# Altium schematic sheet SCH_LoraRemote.SchDoc
size A3; SheetNumber: 1; SheetTotal: 2
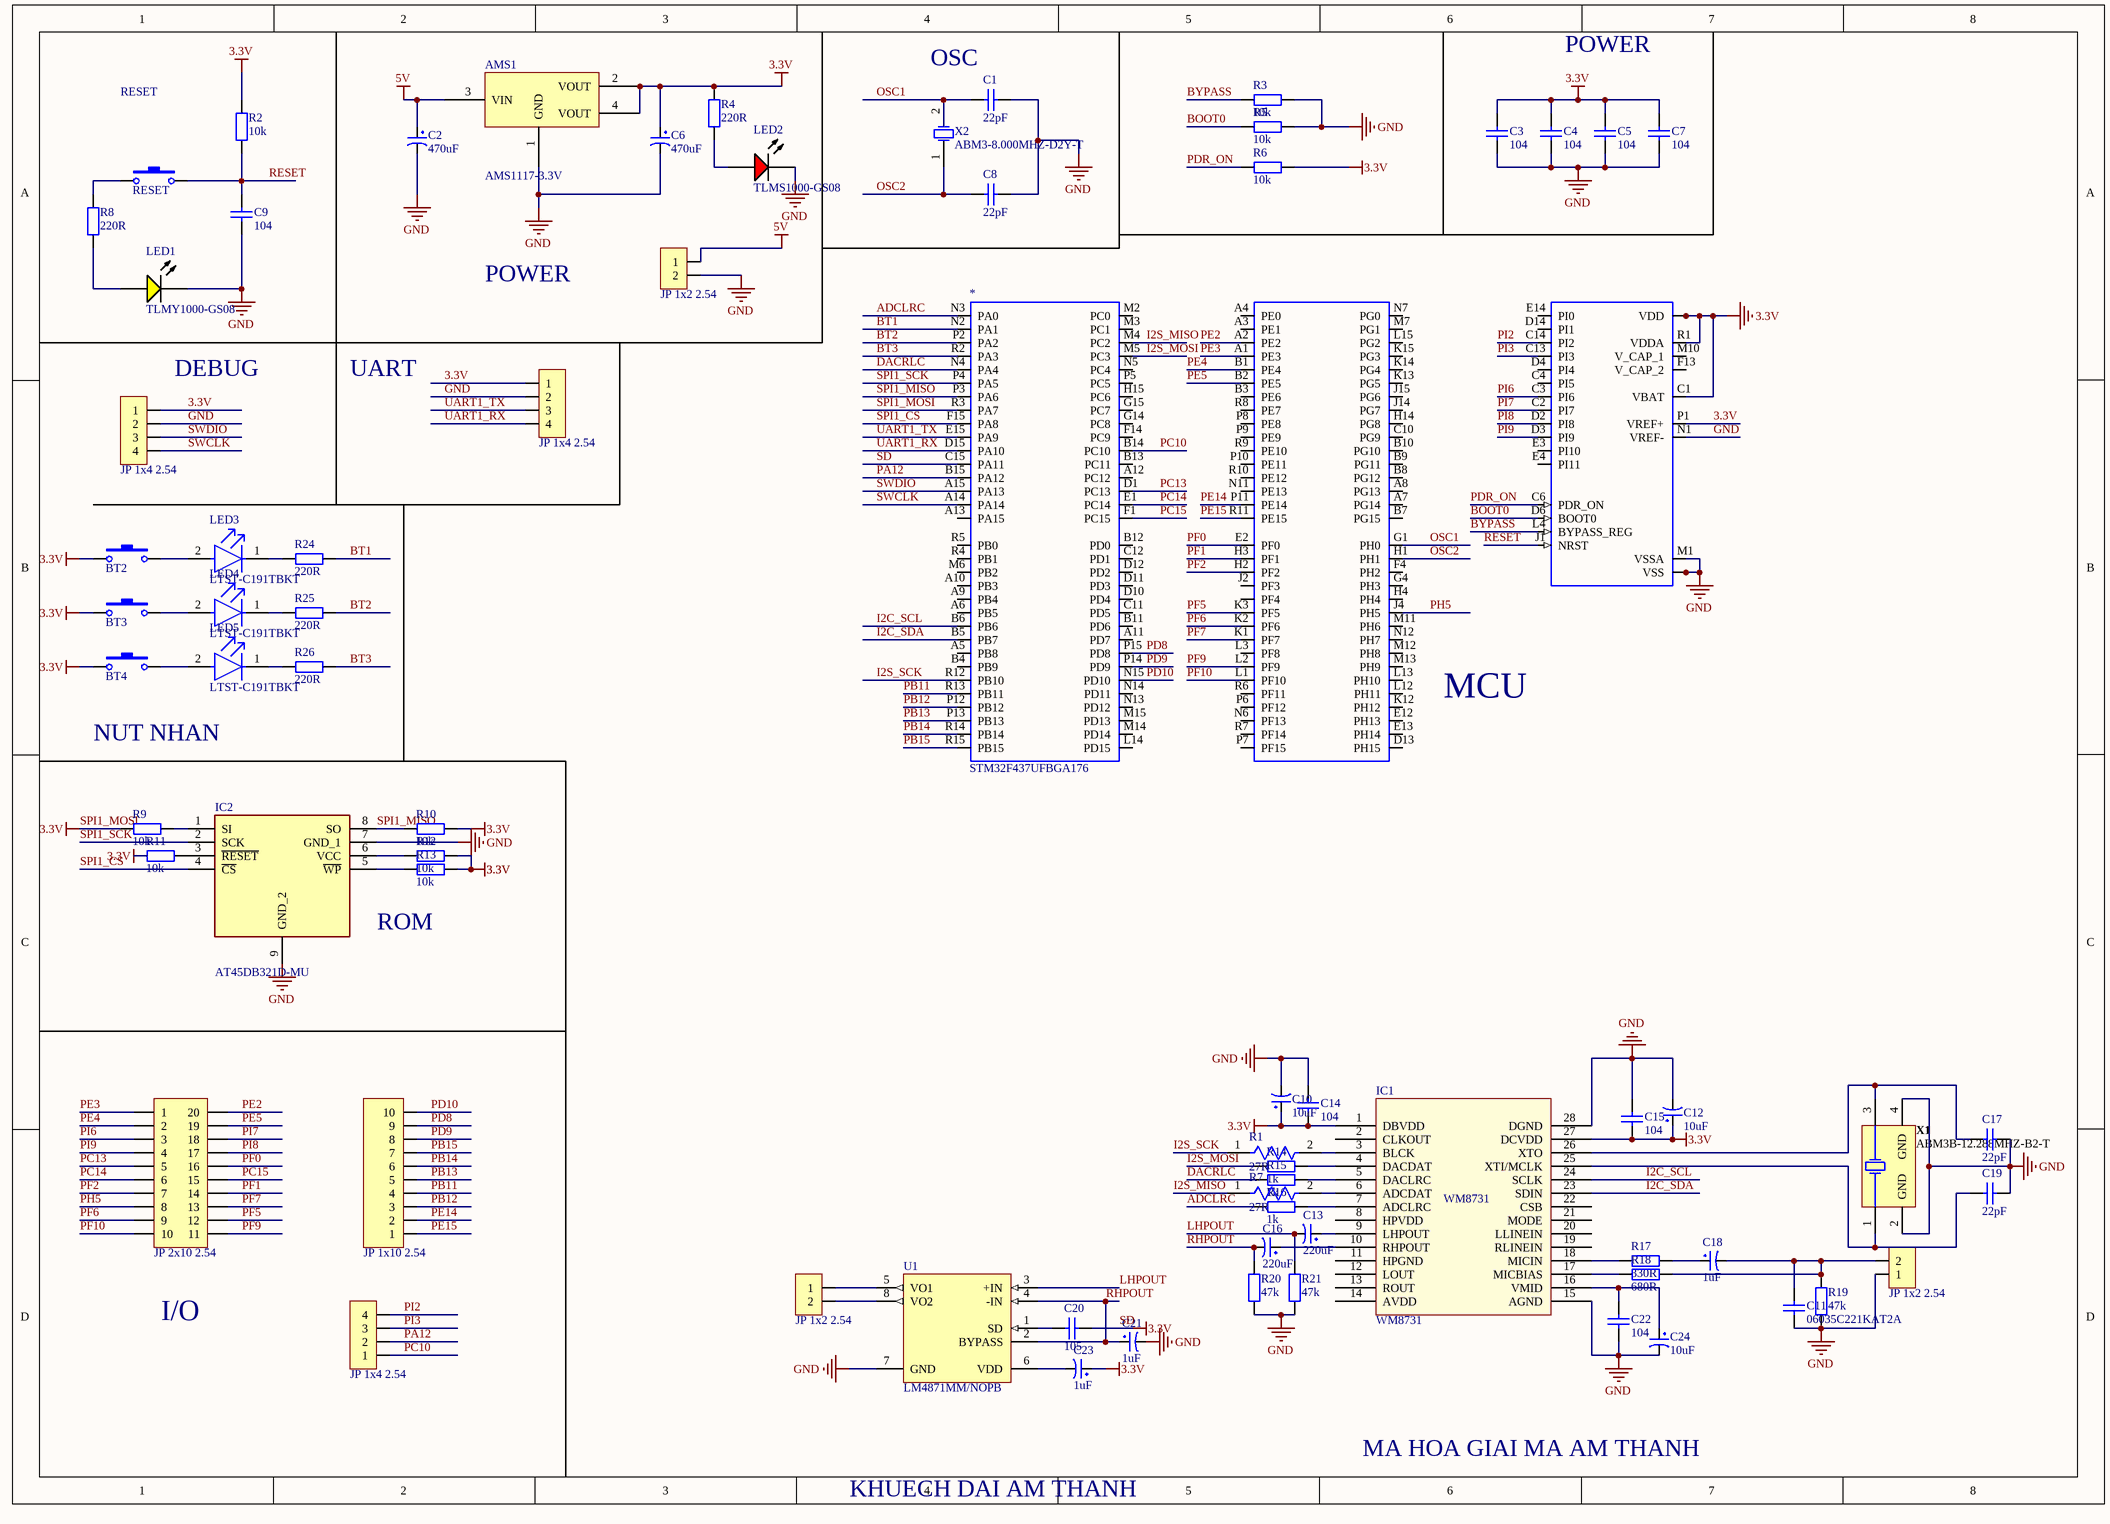
[diagram p0: SCH_LoraRemote.SchDoc]

## Parts
*  STM32F437UFBGA176  [stm32f407BGA176]
?  JP 1x4 2.54  [JP 1x4 DT]
AMS1  AMS1117-3.3V  [SOT223]
BT2  Nut Nhan 2 Chan SMD 3x6x2.5  [Nut Nhan 2 Chan SMD 3x6x2.5]  (value not drawn)
BT3  Nut Nhan 2 Chan SMD 3x6x2.5  [Nut Nhan 2 Chan SMD 3x6x2.5]  (value not drawn)
BT4  Nut Nhan 2 Chan SMD 3x6x2.5  [Nut Nhan 2 Chan SMD 3x6x2.5]  (value not drawn)
C1  22pF  [tu 0603]
C2  470uF  [tu tantalum smd7343]
C3  104  [tu 0603]
C4  104  [tu 0603]
C5  104  [tu 0603]
C6  470uF  [tu tantalum smd7343]
C7  104  [tu 0603]
C8  22pF  [tu 0603]
C9  104  [tu 0603]
C10  10uF  [tu tantalum smd3216]
C11  06035C221KAT2A  [CAPC1608X90X35ML15T15]
C12  10uF  [tu tantalum smd3216]
C13  220uF  [tu tantalum smd7343]
C14  104  [tu 0603]
C15  104  [tu 0603]
C16  220uF  [tu tantalum smd7343]
C17  22pF  [tu 0603]
C18  1uF  [tu tantalum smd3216]
C19  22pF  [tu 0603]
C20  105  [tu 0603]
C21  1uF  [tu tantalum smd3216]
C22  104  [tu 0603]
C23  1uF  [tu tantalum smd3216]
C24  10uF  [tu tantalum smd3216]
IC1  WM8731  [WM8731_SSOP]
IC2  AT45DB321D-MU  [SON127P600X500X100-9N-D]
JP1  JP 1x2 2.54  [JP 1x2 DT]
JP2  JP 1x2 2.54  [JP 1x2 DT]
JP3  JP 1x4 2.54  [JP 1x4 DT]
JP4  JP 1x10 2.54  [JP 1x10 DT]
JP5  JP 1x2 2.54  [JP 1x2 DT]
JP6  JP 2x10 2.54  [JP 2x10 DT]
JP7  JP 1x4 2.54  [JP 1x4 DT]
LED1  TLMY1000-GS08  [VISH-TLMY1000_V]
LED2  TLMS1000-GS08  [VISH-TLMS1000_V]
LED3  LTST-C191TBKT  [FP-LTST-C191TBKT-MFG]
LED4  LTST-C191TBKT  [FP-LTST-C191TBKT-MFG]
LED5  LTST-C191TBKT  [FP-LTST-C191TBKT-MFG]
R1  27R  [FP-CRCW0603-HPe3-IPC_B]
R2  10k  [tro smd 0603]
R3  10k  [tro smd 0603]
R4  220R  [tro smd 0603]
R5  10k  [tro smd 0603]
R6  10k  [tro smd 0603]
R7  27R  [FP-CRCW0603-HPe3-IPC_B]
R8  220R  [tro smd 0603]
R9  10k  [tro smd 0603]
R10  10k  [tro smd 0603]
R11  10k  [tro smd 0603]
R12  10k  [tro smd 0603]
R13  10k  [tro smd 0603]
R14  1k  [tro smd 0603]
R15  1k  [tro smd 0603]
R16  1k  [tro smd 0603]
R17  330R  [tro smd 0603]
R18  680R  [tro smd 0603]
R19  47k  [tro smd 0603]
R20  47k  [tro smd 0603]
R21  47k  [tro smd 0603]
R24  220R  [tro smd 0603]
R25  220R  [tro smd 0603]
R26  220R  [tro smd 0603]
RESET  Nut Nhan 2 Chan SMD 3x6x2.5  [Nut Nhan 2 Chan SMD 3x6x2.5]  (value not drawn)
U1  LM4871MM/NOPB  [DGK0008A_L]
X1  ABM3B-12.288MHZ-B2-T  [ABRA-ABM3B-4_V]
X2  ABM3-8.000MHZ-D2Y-T  [ABRA-ABM3-2_V]

## Nets
3.3V: *.C1(VBAT) *.C5(VDD) *.C7(VDD) *.C8(VDD) *.C9(VDD) *.C15(PA11) *.F3(VDD) *.G3(VDD) *.G13(VDD) *.H13(VDD) *.J12(VDD) *.J13(VDD) *.K4(VDD) *.N8(VDD) *.N9(VDD) *.N10(VDD) *.P1(VREF+) *.R1(VDDA) *.R3(PA7) ?.1 AMS1.2(VOUT) AMS1.4(VOUT) BT2.1 BT3.1 BT4.1 C3.1 C4.1 C5.1 C6.1 C7.1 C10.1 C12.1 C14.2 C15.2 C20.1 C23.1 IC1.1(DBVDD) IC1.27(DCVDD) JP3.1 R2.2 R4.2 R6.2 R9.1 R10.2 R11.1 R12.2 R13.2  [also labelled SD, SPI1_MOSI]
5V: AMS1.3(VIN) C2.1 JP1.1
GND: *.D5(VSS) *.D7(VSS) *.D8(VSS) *.D9(VSS) *.F2(VSS) *.F6(VSS) *.F7(VSS) *.F8(VSS) *.F9(VSS) *.F10(VSS) *.F12(VSS) *.G2(VSS) *.G6(VSS) *.G7(VSS) *.G8(VSS) *.G9(VSS) *.G10(VSS) *.G12(VSS) *.H6(VSS) *.H7(VSS) *.H8(VSS) *.H9(VSS) *.H10(VSS) *.H12(VSS) *.J6(VSS) *.J7(VSS) *.J8(VSS) *.J9(VSS) *.J10(VSS) *.K6(VSS) *.K7(VSS) *.K8(VSS) *.K9(VSS) *.K10(VSS) *.M1(VSSA) *.M8(VSS) *.M9(VSS) *.N1(VREF-) ?.2 AMS1.1(GND) C1.1 C2.2 C3.2 C4.2 C5.2 C6.2 C7.2 C8.1 C9.2 C10.2 C11.1 C12.2 C14.1 C15.1 C17.1 C19.1 C21.2 C22.2 C24.2 IC1.15(AGND) IC1.28(DGND) IC2.7(GND_1) IC2.9(GND_2) JP1.2 JP3.2 JP5.1 LED1.2(K) LED2.2(K) R3.2 R5.2 R19.1 R20.1 R21.1 U1.7(GND) X1.2(GND) X1.4(GND)
ADCLRC: *.N3(PA0) R16.1
BOOT0: *.D6(BOOT0) R5.1
BT1: *.N2(PA1) R24.2
BT2: *.P2(PA2) R25.2
BT3: *.R2(PA3) R26.2
BYPASS: *.L4(BYPASS_REG) R3.1
DACRLC: *.N4(PA4) R15.1
I2C_SCL: *.B6(PB6) IC1.24(SCLK)
I2C_SDA: *.B5(PB7) IC1.23(SDIN)
I2S_MISO: *.M4(PC2) R7.1
I2S_MOSI: *.M5(PC3) R14.1
I2S_SCK: *.R12(PB10) R1.1
LHPOUT: C13.2 R21.2 U1.3(+IN)
OSC1: *.G1(PH0) C1.2 X2.2(X2)
OSC2: *.H1(PH1) C8.2 X2.1(X1)
PA12: *.B15(PA12) JP7.2
PB11: *.R13(PB11) JP4.4
PB12: *.P12(PB12) JP4.3
PB13: *.P13(PB13) JP4.5
PB14: *.R14(PB14) JP4.6
PB15: *.R15(PB15) JP4.7
PC10: *.B14(PC10) JP7.1
PC13: *.D1(PC13) JP6.5
PC14: *.E1(PC14) JP6.6
PC15: *.F1(PC15) JP6.15
PD8: *.P15(PD8) JP4.9
PD9: *.P14(PD9) JP4.8
PD10: *.N15(PD10) JP4.10
PDR_ON: *.C6(PDR_ON) R6.1
PE2: *.A2(PE2) JP6.20
PE3: *.A1(PE3) JP6.1
PE4: *.B1(PE4) JP6.2
PE5: *.B2(PE5) JP6.19
PE14: *.P11(PE14) JP4.2
PE15: *.R11(PE15) JP4.1
PF0: *.E2(PF0) JP6.16
PF1: *.H3(PF1) JP6.14
PF2: *.H2(PF2) JP6.7
PF5: *.K3(PF5) JP6.12
PF6: *.K2(PF6) JP6.9
PF7: *.K1(PF7) JP6.13
PF9: *.L2(PF9) JP6.11
PF10: *.L1(PF10) JP6.10
PH5: *.J4(PH5) JP6.8
PI2: *.C14(PI2) JP7.4
PI3: *.C13(PI3) JP7.3
PI6: *.C3(PI6) JP6.3
PI7: *.C2(PI7) JP6.18
PI8: *.D2(PI8) JP6.17
PI9: *.D3(PI9) JP6.4
RESET: *.J1(NRST) C9.1 R2.1 RESET.2
RHPOUT: C16.2 C21.1 R20.2 U1.2(BYPASS) U1.4(-IN)
SPI1_CS: *.F15(PA8) IC2.4(~{CS})
SPI1_MISO: *.P3(PA6) IC2.8(SO) R10.1
SPI1_SCK: *.P4(PA5) IC2.2(SCK)
SWCLK: *.A14(PA14) JP3.4
SWDIO: *.A15(PA13) JP3.3
UART1_RX: *.D15(PA10) ?.4
UART1_TX: *.E15(PA9) ?.3
NetBT2_2: BT2.2 LED3.2(A)
NetBT3_2: BT3.2 LED4.2(A)
NetBT4_2: BT4.2 LED5.2(A)
NetC11_2: C11.2 C18.2 JP5.2 R18.2 R19.2
NetC13_1: C13.1 IC1.9(LHPOUT)
NetC16_1: C16.1 IC1.10(RHPOUT)
NetC17_2: C17.2 IC1.26(XTO) X1.3(X2)
NetC18_1: C18.1 R17.2
NetC19_2: C19.2 IC1.25(XTI/MCLK) X1.1(X1)
NetC20_2: C20.2 U1.1(SD)
NetC22_1: C22.1 C24.1 IC1.16(VMID)
NetC23_2: C23.2 U1.6(VDD)
NetIC1_3: IC1.3(BLCK) R1.2
NetIC1_4: IC1.4(DACDAT) R14.2
NetIC1_5: IC1.5(DACLRC) R15.2
NetIC1_6: IC1.6(ADCDAT) R7.2
NetIC1_7: IC1.7(ADCLRC) R16.2
NetIC1_17: IC1.17(MICBIAS) R18.1
NetIC1_18: IC1.18(MICIN) R17.1
NetIC2_1: IC2.1(SI) R9.2
NetIC2_3: IC2.3(~{RESET}) R11.2
NetIC2_5: IC2.5(~{WP}) R13.1
NetIC2_6: IC2.6(VCC) R12.1
NetJP2_1: JP2.1 U1.5(VO1)
NetJP2_2: JP2.2 U1.8(VO2)
NetLED1_1: LED1.1(A) R8.1
NetLED2_1: LED2.1(A) R4.1
NetLED3_1: LED3.1(C) R24.1
NetLED4_1: LED4.1(C) R25.1
NetLED5_1: LED5.1(C) R26.1
NetR8_2: R8.2 RESET.1

Not connected (* = marked no-connect by the designer): * ?1(PF4) A3(PE1) A4(PE0) A5(PB8) A6(PB5) A7(PG14) A8(PG13) A9(PB4) A10(PB3) A11(PD7) A12(PC12) A13(PA15) B3(PE6) B4(PB9) B7(PG15) B8(PG12) B9(PG11) B10(PG10) B11(PD6) B12(PD0) B13(PC11) C4(PI5) C10(PG9) C11(PD5) C12(PD1) D4(PI4) D10(PD4) D11(PD3) D12(PD2) D13(PH15) D14(PI1) E3(PI10) E4(PI11) E12(PH13) E13(PH14) E14(PI0) F4(PH2) F13(V_CAP_2) F14(PC9) G4(PH3) G14(PC8) G15(PC7) H4(PH4) H14(PG8) H15(PC6) J2(PF3) J14(PG7) J15(PG6) K12(PH12) K13(PG5) K14(PG4) K15(PG3) L3(PF8) L12(PH11) L13(PH10) L14(PD15) L15(PG2) M2(PC0) M3(PC1) M6(PB2) M7(PG1) M10(V_CAP_1) M11(PH6) M12(PH8) M13(PH9) M14(PD14) M15(PD13) N5(PC4) N6(PF13) N7(PG0) N11(PE13) N12(PH7) N13(PD12) N14(PD11) P5(PC5) P6(PF12) P7(PF15) P8(PE8) P9(PE9) P10(PE11) R4(PB1) R5(PB0) R6(PF11) R7(PF14) R8(PE7) R9(PE10) R10(PE12); IC1 2(CLKOUT) 8(HPVDD) 11(HPGND) 12(LOUT) 13(ROUT) 14(AVDD) 19(RLINEIN) 20(LLINEIN) 21(MODE) 22(CSB)

## Notes on the sheet
- RESET
- (near C1) OSC
- POWER
- (near JP3) DEBUG
- UART
- (near *) MCU
- NUT NHAN
- ROM
- I/O
- MA HOA GIAI MA AM THANH
- KHUECH DAI AM THANH

## Library data of the parts
? JP3 JP7 = JP 1x4 2.54 Duc Thang: Cắm; Ten_Linh_Kien: Jump Đơn Đực 2.54MM 1x40P Thẳng 11MM; Don_Vi: Con; Ma_Hang: MH000903; Ghi_Chu: *; Kieu_Chan: *; Chung_Loai: Cắm
AMS1 = AMS1117 SMD: Dán; Value: AMS1117-3.3V SOT223; Don_Vi: Con; Ma_Hang: MH000596; Ghi_Chu: *; Kieu_Chan: *; Chung_Loai: Dán
BT2-BT4 RESET = Nut Nhan 2 Chan SMD 3x6x2.5: Ma_Hang: MH001036; Ten: Nút Nhấn 2 Chân 3x6x2.5MM SMD
C1 C8 C17 C19 = Tu 0603 22pF 50V 10%: Dán; Don_Vi: Con; So_Chan: 2; Ten_Linh_Kien: Tụ 0603 22pF 50V 10%; Ma_Hang: MH004570; Chung_Loai: Dán; Kieu_Chan: *
C2 C6 = Tu tantalum 470uF 10V SMD7343: Dán; Don_Vi: Con; So_Chan: 2; Ten_Linh_Kien: Tụ tantalum 477A-470uF 10V SMD7343; Ma_Hang: MH001956; Chung_Loai: Dán; Kieu_Chan: *
C3-C5 C7 C9 C14 C15 C22 = Tu 0603 104 50V 10%: Dán; Don_Vi: Con; So_Chan: 2; Ten_Linh_Kien: Tụ 0603 104-100nF 10% 50V; Ma_Hang: MH004568; Chung_Loai: Dán; Kieu_Chan: *
C10 C12 C24 = Tu tantalum 10uF 16V SMD3216: Dán; Don_Vi: Con; So_Chan: 2; Ten_Linh_Kien: Tụ tantalum 106C-10uF 16V SMD3216; Ma_Hang: MH001954; Chung_Loai: Dán; Kieu_Chan: *
C11 = CMP-2006-04408-1: Manufacturer: AVX Interconnect / Elco; Part Number: 06035C221KAT2A
C13 C16 = Tu tantalum 220uF 10V SMD7343: Dán; Don_Vi: Con; So_Chan: 2; Ten_Linh_Kien: Tụ tantalum 227A-220uF 10V SMD 7343; Ma_Hang: MH007496; Chung_Loai: Dán; Kieu_Chan: *
C18 = Tu tantalum 1uF 25V SMD3216: Dán; Don_Vi: Con; So_Chan: 2; Ten_Linh_Kien: Tụ tantalum 105E-1uF 25V SMD3216; Ma_Hang: MH007472; Chung_Loai: Dán; Kieu_Chan: *
C20 = Tu 0603 105 16V 20%: Dán; Don_Vi: Con; So_Chan: 2; Ten_Linh_Kien: Tụ 0603 105-1uF 20% 16V; Ma_Hang: MH004574; Chung_Loai: Dán; Kieu_Chan: *
C21 C23 = Tu tantalum 1uF 35V SMD3216: Dán; Don_Vi: Con; So_Chan: 2; Ten_Linh_Kien: Tụ tantalum 105V-1uF 35V SMD3216; Ma_Hang: MH007471; Chung_Loai: Dán; Kieu_Chan: *
IC1 = WM8731_SSOP
IC2 = AT45DB321D-MU: Integrated Circuit; Manufacturer_Name: Adesto Technologies; Datasheet Link: https://www.adestotech.com/wp-content/uploads/doc3597.pdf; Height: 1mm; Manufacturer_Part_Number: AT45DB321D-MU; Mouser Part Number: 556-AT45DB321D-MU; Mouser Price/Stock: https://www.mouser.co.uk/ProductDetail/Adesto-Technologies/AT45DB321D-MU?qs=S%2FDyAMLKE9jfaspXvIc%252B6Q%3D%3D
JP1 JP2 JP5 = JP 1x2 2.54 Duc Thang: Cắm; Ten_Linh_Kien: Jump Đơn Đực 2.54MM 1x40P Thẳng 11MM; Don_Vi: Con; Ma_Hang: MH000903; Ghi_Chu: *; Kieu_Chan: *; Chung_Loai: Cắm
JP4 = JP 1x10 2.54 Duc Thang: Cắm; Ten_Linh_Kien: Jump Đơn Đực 2.54MM 1x40P Thẳng 11MM; Don_Vi: Con; Ma_Hang: MH000903; Ghi_Chu: *; Kieu_Chan: *; Chung_Loai: Cắm
JP6 = JP 2x10 2.54 Duc Thang: Cắm; Ten_Linh_Kien: Jump Đôi Đực 2.54MM 2x40P Thẳng 11MM; Don_Vi: Con; Ma_Hang: MH002686; Ghi_Chu: *; Kieu_Chan: *; Chung_Loai: Cắm
LED1 = CMP-2000-07255-1: Low Current LED, 40 mW, -40 to 100 degC, 2-Pin SMD, RoHS, Tape and Reel; Manufacturer: Vishay; Wavelength Typ: 595nm; Forward Current If: 2mA; Viewing Angle: 80°; Bulb Size: 1.6mmx0.8mm; Forward Voltage: 1.8V; Luminous Intensity: 7.5mcd; SVHC: ToBeAdvised; Automotive Qualification Standard: AEC-Q100; LED Colour: Yellow; Lens Shape: Rectangular; LED Mounting: SMD; Mounting Technology: SurfaceMount; Packaging: CutTape; MSL: MSL2-1year; Datasheet URL: http://www.vishay.com/docs/83172/tlmo1000.pdf; Package Reference: TLMY1000; Manufacturer URL: http://www.vishay.com/; Package Description: 2-Pin Surface Mount Device, Body 1.6 x 0.8 mm; Datasheet Version: Rev. 2.0, 09/2013; Product Range: -
LED2 = CMP-2000-07254-1: Low Current LED, 40 mW, 1.8 V, -40 to 100 degC, 2-Pin SMD (0603), RoHS, Tape and Reel; Manufacturer: Vishay; Lens Shape: Rectangular; Automotive Qualification Standard: AEC-Q100; Wavelength Typ: 636nm; SVHC: ToBeAdvised; LED Colour: Red; Bulb Size: 1.6mmx0.8mm; Forward Voltage: 1.8V; Luminous Intensity: 4mcd; Forward Current If: 2mA; Viewing Angle: 80°; Datasheet Version: Rev. 1.7, 02/2011; Datasheet URL: https://datasheet.ciiva.com/5798/1698881-5798337.pdf; LED Mounting: SMD; Packaging: CutTape; Package Reference: TLMS1000; Manufacturer URL: http://www.vishay.com/; Mounting Technology: SurfaceMount; Product Range: -; Package Description: 2-Pin Surface Mount Device, Body 1.6 x 0.8 mm; MSL: MSL2-1year
LED3-LED5 = CMP-22017-000008-1: LED BLUE CLEAR CHIP SMD; Lens Color: Colorless; Dominant Wavelength: 475nm; Forward Current: 20mA; Wavelength: 468nm; Viewing Angle: 130°; Power Dissipation: 76mW; Luminous Intensity: 180mcd; Reverse Voltage: 5V; Number of Elements: 1; Lens Style: Diffused; Forward Voltage: 3.8V; Max Power Dissipation: 75mW; Case Code (Metric): 1608; Packaging: Tape and Reel; Case/Package: 0603; Depth: 1.6mm; Mount: Surface Mount; Lead Free: Lead Free; Min Operating Temperature: -20°C; Lens Transparency: Clear; Illumination Color: Blue; Height: 0.55mm; Test Current: 20mA; Case Code (Imperial): 0603; Max Operating Temperature: 80°C; Number of Pins: 2; Length: 0.8mm; Radiation Hardening: No; Package Quantity: 1; Number of LEDs: 1; Width: 0.8mm; Color: Blue
R1 R7 = CMP-02407-007306-1: RES Thick Film, 27Ω, 1%, 0.33W, 100ppm/°C, 0603; Power Rating: 250mW; Voltage Rating: 75V; Resistance: 27R; Termination: SMD/SMT; Lead Free: Lead Free; Max Power Dissipation: 250mW; Length: 1.6mm; Features: Automotive AEC-Q200; Voltage Rating (DC): 75V; Package Quantity: 5000; Mount: Surface Mount; Case Code (Imperial): 0603; Case Code (Metric): 1608; Case/Package: 0603; Packaging: Tape and Reel; Number of Terminations: 2; Max Operating Temperature: 155°C; Radiation Hardening: No; Height: 0.45mm; Min Operating Temperature: -55°C; Contact Plating: Tin; Tolerance: 1%; Military Standard: Not; Depth: 0.85mm; Temperature Coefficient: 100ppm/°C; Width: 0.033inch; Composition: Thick Film
R2 = Tro 0603 5% 10k: Dán; Don_Vi: Con; So_Chan: 2; Ten_Linh_Kien: Trở 0603 5% 10k; Ma_Hang: MH006316; Chung_Loai: Dán; Kieu_Chan: *
R3 R5 R6 R9-R13 = Tro 0603 1% 10k: Dán; Don_Vi: Con; So_Chan: 2; Ten_Linh_Kien: Trở 0603 1% 10k; Ma_Hang: MH006333; Chung_Loai: Dán; Kieu_Chan: *
R4 R8 R24-R26 = Tro 0603 5% 220R: Dán; Don_Vi: Con; So_Chan: 2; Ten_Linh_Kien: Trở 0603 5% 220R; Ma_Hang: MH006322; Chung_Loai: Dán; Kieu_Chan: *
R14-R16 = Tro 0603 1% 1k: Dán; So_Chan: 2; Don_Vi: Con; Ten_Linh_Kien: Trở 0603 1% 1k; Ma_Hang: MH006334; Chung_Loai: Dán; Kieu_Chan: *
R17 = Tro 0603 5% 330R: Dán; Don_Vi: Con; Ma_Hang: MH006910; So_Chan: 2; Ten_Linh_Kien: Trở 0603 5% 330R; Chung_Loai: Dán; Kieu_Chan: *
R18 = Tro 0603 1% 680R: Dán; Don_Vi: Con; So_Chan: 2; Ten_Linh_Kien: Trở 0603 1% 680R; Ma_Hang: MH006336; Chung_Loai: Dán; Kieu_Chan: *
R19-R21 = Tro 0603 5% 47k: Dán; Chung_loai: Dám; Don_Vi: Con; So_Chan: 2; Ten_Linh_Kien: Trở 0603 5% 47k; Ma_Hang: MH007665; Kieu_Chan: *
U1 = CMP-0057-00542-3: 3W Audio Power Amplifier with Shutdown Mode, 8-pin Mini SOIC, Pb-Free; Manufacturer: Texas Instruments; PowerWise: N; PackageTopMarking: ZXTT*G71; CompType: Audio IC; ComponentLink1URL: http://www.ti.com/general/docs/lit/getliterature.tsp?genericPartNumber=LM4871&fileType=pdf; PackageReference: DGK0008A; RoHS: Y; ComponentLink1Description: Datasheet URL; PackageDescription: MINI SOIC, .118 x .118 x .034in, 8 Lead, .0256in Pitch; Code_JEDEC: MO-187-AA; PinCount: 8
X1 = CMP-1688-00004-1: Ceramic SMD Crystal, 12.288 MHz, +/- 20 ppm, 70 Ohm, -20 to 70 degC, 4-Pin SMD, RoHS, Tape and Reel; Max Surge Current: 600 mA; Forward Voltage: 1 V; Case\Package: TO-236-3; Weight: 0.00031 oz; DatasheetVersion: Aug-15; PackageDescription: 4-Pin Surface Mount Device, Body 5 x 3.2 mm; ComponentLink2URL: http://www.abracon.com/Resonators/abm3b.pdf; Mount: Surface Mount; RoHSCompliant: true; ComponentLink2Description: Datasheet; ComponentLink1Description: Manufacturer URL; Max Operating Temperature: 125 degC; Packaging: Tape and Reel; ComponentLink1URL: http://www.abracon.com/; Package Quantity: 1; REACH SVHC: Unknown; Min Operating Temperature: -55 degC; Radiation Hardening: No; PackageReference: ABM3B; Pins: 3
X2 = CMP-2000-05033-1: Miniature Ceramic Crystal, 8 MHz, -40 to 85 degC, 2-Pin SMD, RoHS, Tape and Reel; Manufacturer: ABRACON; Case Length: 5mm; Case Width: 3.2mm; Case Height: 1.3mm; Load Capacitance: 18pF; Frequency: 8MHz; Frequency Stability: 30PPM; ESR: 140Ohms; Tolerance: 20PPM; Type: MiniatureCeramicCrystal; Factory Pack Quantity: 1000; Package / Case: 5mmx3.2mm; Mounting Style: SMD/SMT; Manufacturer URL: http://www.abracon.com/; RoHS: Details; Dimensions: 3.2mmWx5mmLx1.3mmH; Datasheet URL: http://www.farnell.com/datasheets/1754353.pdf; Brand: ABRACON; Packaging: Reel; Product Category: Crystals; Package Description: 2-Pin Surface Mount Device, Body 5 x 3.2 mm; Package URL: http://www.abracon.com/Support/PackageDrawing/Resonators/ABM3.PDF; Operating Temperature Range: -40Cto+85C; Termination Style: SMD/SMT; Datasheet Version: Sep-13; Series: ABM3; Package Reference: ABM3-2